# Altium project HORNET_MOTOR_CONTROLLER.PrjPcb (part 1 of 2)
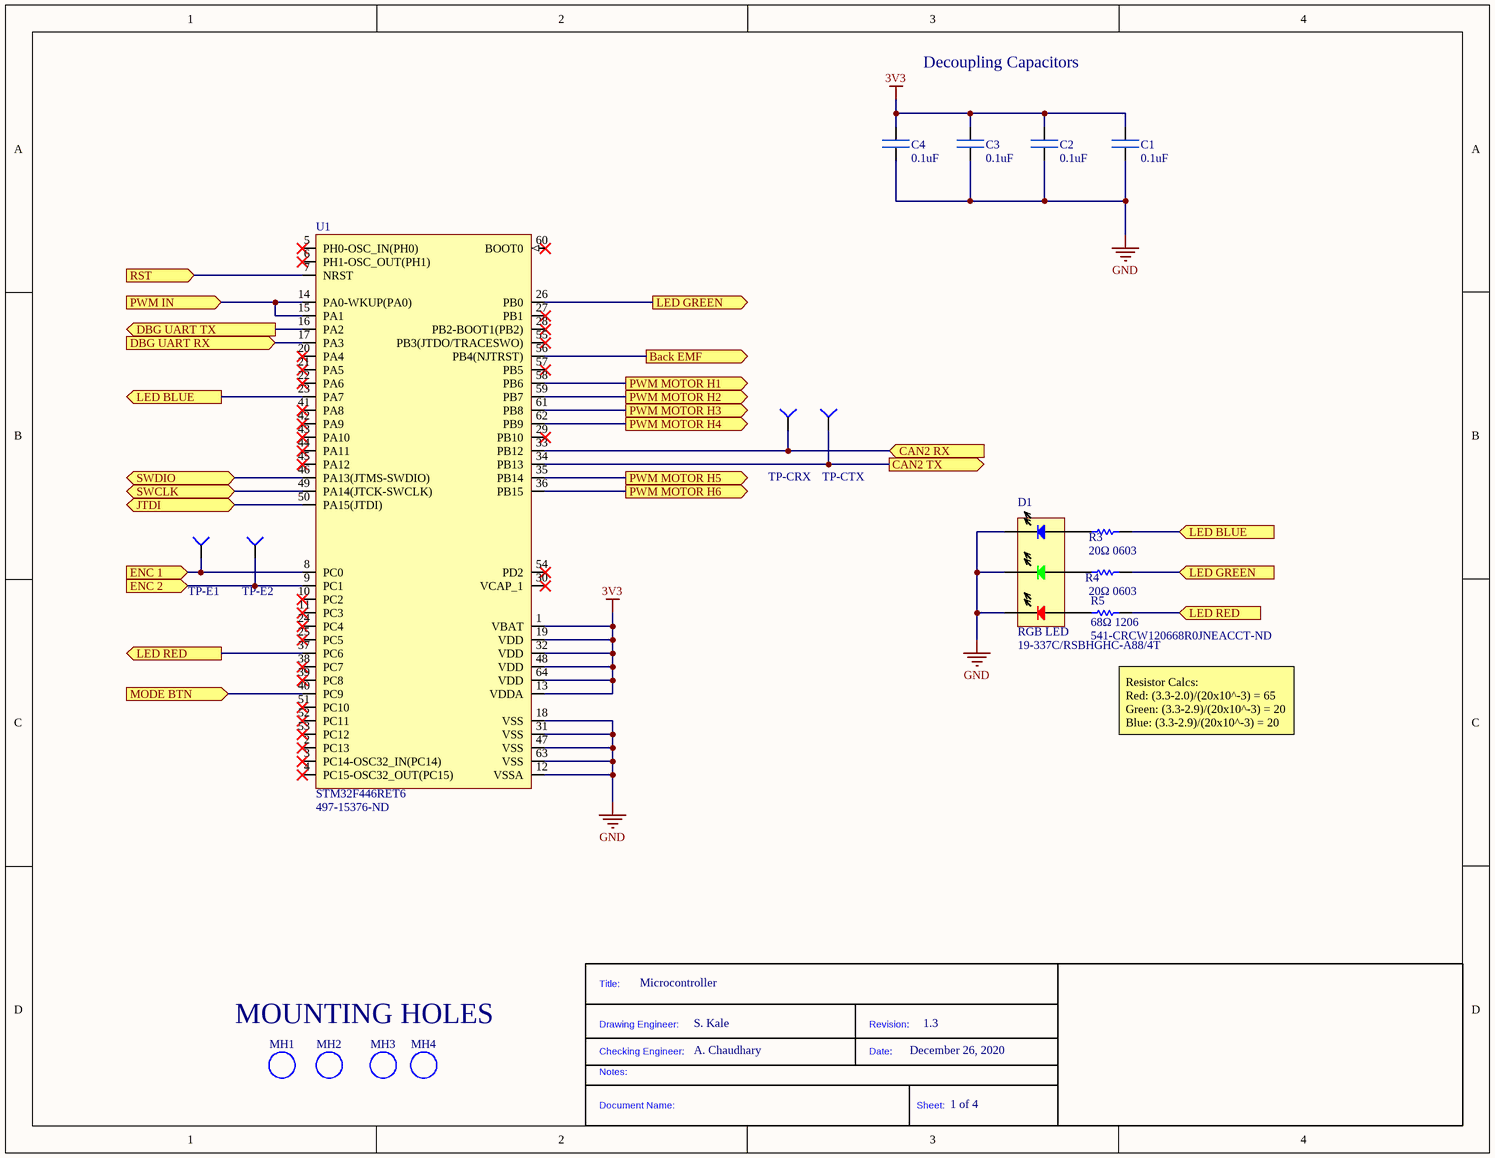
[diagram p0: SH1 - STM32.SchDoc]
4 sheets, 88 parts. Net scope: flat (ports and power ports of the same name join across sheets).
Board file: HornetPCB.PcbDoc
Sheets:
  SH1 - STM32.SchDoc
  SH2 - HBridge.SchDoc
  SH3 - Debug Communication.SchDoc
  SH4 - PWM + CAN.SchDoc

## Sheet SH1 - STM32.SchDoc
size Letter

### Parts
(Parts that share a designator on the sheet are numbered #1, #2 ... from top to bottom, then left to right.)
*  HORNET LOGO  (value not drawn)  (graphical)
?#1  TitleBlock  (value not drawn)  (graphical)
C1  0.1uF  [CAP0.1uF]
C2  0.1uF  [CAP0.1uF]
C3  0.1uF  [CAP0.1uF]
C4  0.1uF  [CAP0.1uF]
D1  RGB LED  [19-337C/RSBHGHC-A88/4T]
MH1  MOUNTING HOLE  [MOUNTING HOLE]  (value not drawn)
MH2  MOUNTING HOLE  [MOUNTING HOLE]  (value not drawn)
MH3  MOUNTING HOLE  [MOUNTING HOLE]  (value not drawn)
MH4  MOUNTING HOLE  [MOUNTING HOLE]  (value not drawn)
R3  20Ω 0603  [SDR03EZPJ200]
R4  20Ω 0603  [SDR03EZPJ200]
R5  68Ω 1206  Supplier Part Number 1: 541-CRCW120668R0JNEACCT-ND  [CRCW120668R0JNEAC]
TP-CRX  TESTPT  [TESTPT SQUARE]  (value not drawn)
TP-CTX  TESTPT  [TESTPT SQUARE]  (value not drawn)
TP-E1  TESTPT  [TESTPT SQUARE]  (value not drawn)
TP-E2  TESTPT  [TESTPT SQUARE]  (value not drawn)
U1  STM32F446RET6  Supplier Part Number 1: 497-15376-ND  [STM_LQFP64_N]

### Ports
Back EMF (out), CAN2 RX (in), CAN2 TX (out), DBG UART RX (in), DBG UART TX (out), ENC 1 (in), ENC 2 (in), JTDI (bidir), LED BLUE (in), LED BLUE (out), LED GREEN (in), LED GREEN (out), LED RED (in), LED RED (out), MODE BTN (in), PWM IN (in), PWM MOTOR H1 (out), PWM MOTOR H2 (out), PWM MOTOR H3 (out), PWM MOTOR H4 (out), PWM MOTOR H5 (out), PWM MOTOR H6 (out), RST (in), SWCLK (bidir), SWDIO (bidir)

### Nets
3V3: C1.2 C2.2 C3.2 C4.2 U1.1(VBAT) U1.13(VDDA) U1.19(VDD) U1.32(VDD) U1.48(VDD) U1.64(VDD)
GND: C1.1 C2.1 C3.1 C4.1 D1.1(GREEN_-) D1.3(RED_-) D1.5(BLUE_-) U1.12(VSSA) U1.18(VSS) U1.31(VSS) U1.47(VSS) U1.63(VSS)
NetD1_2: D1.2(Green_+) R4.1
NetD1_4: D1.4(Red_+) R5.1
NetD1_6: D1.6(Blue_+) R3.1
NetJ0_1: TP-E1.1(=value) U1.8(PC0) ; port ENC 1
NetJ1_1: TP-E2.1(=value) U1.9(PC1) ; port ENC 2
NetJ8_1: U1.7(NRST) ; port RST
NetJ8_2: U1.46(PA13(JTMS-SWDIO)) ; port SWDIO
NetJ8_5: U1.50(PA15(JTDI)) ; port JTDI
NetJ8_6: U1.49(PA14(JTCK-SWCLK)) ; port SWCLK
NetMODE_2: U1.40(PC9) ; port MODE BTN
NetQ1_1: U1.58(PB6) ; port PWM MOTOR H1
NetQ2_1: U1.59(PB7) ; port PWM MOTOR H2
NetQ3_1: U1.61(PB8) ; port PWM MOTOR H3
NetQ4_1: U1.62(PB9) ; port PWM MOTOR H4
NetQ5_1: U1.35(PB14) ; port PWM MOTOR H5
NetQ6_1: U1.36(PB15) ; port PWM MOTOR H6
NetQ7_1: U1.56(PB4(NJTRST)) ; port Back EMF
NetR3_2: R3.2 U1.23(PA7) ; port LED BLUE
NetR4_2: R4.2 U1.26(PB0) ; port LED GREEN
NetR5_2: R5.2 U1.37(PC6) ; port LED RED
NetR10_2: U1.17(PA3) ; port DBG UART RX
NetR11_2: U1.16(PA2) ; port DBG UART TX
NetR21_2: U1.14(PA0-WKUP(PA0)) U1.15(PA1) ; port PWM IN
NetTP-CRX_1: TP-CRX.1(=value) U1.33(PB12) ; port CAN2 RX
NetTP-CTX_1: TP-CTX.1(=value) U1.34(PB13) ; port CAN2 TX

Not connected (* = marked no-connect by the designer): U1 2(PC13)* 3(PC14-OSC32_IN(PC14))* 4(PC15-OSC32_OUT(PC15))* 5(PH0-OSC_IN(PH0))* 6(PH1-OSC_OUT(PH1))* 10(PC2)* 11(PC3)* 20(PA4)* 21(PA5)* 22(PA6)* 24(PC4)* 25(PC5)* 27(PB1)* 28(PB2-BOOT1(PB2))* 29(PB10)* 30(VCAP_1)* 38(PC7)* 39(PC8)* 41(PA8)* 42(PA9)* 43(PA10)* 44(PA11)* 45(PA12)* 51(PC10)* 52(PC11)* 53(PC12)* 54(PD2)* 55(PB3(JTDO/TRACESWO))* 57(PB5)* 60(BOOT0)*

### Notes on the sheet
- Decoupling Capacitors
- Resistor Calcs:
  Red: (3.3-2.0)/(20x10^-3) = 65
  Green: (3.3-2.9)/(20x10^-3) = 20
  Blue: (3.3-2.9)/(20x10^-3) = 20
- MOUNTING HOLES
- Microcontroller
- S. Kale
- 1.3
- A. Chaudhary
- December 26, 2020
- 1 of 4
- (in symbol TitleBlock) Title:; Drawing Engineer:; Revision:; Checking Engineer:; Date:; Notes:; Document Name:; Sheet:

### Library data of the parts
?#1 = TitleBlock: Standard Title Block
C1-C4 = CAP 0.1uF: Ceramic Capacitor, Multilayer, Ceramic, 16V, 10% +Tol, 10% -Tol, X7R, 15% TC, 0.1uF, Surface Mount, 0402; Manufacturer: Murata; Manufacturer Part Number: GRM155R71C104KA88D; Capacitance: 100nF; Multilayer: Yes; Supplier 1: Digi-Key; RoHS: Yes; Category: Ceramic Capacitors; Stock 1: 19996896; Pricing 1: 1=0.10000, 10=0.02100, 50=0.01140, 100=0.00930, 500=0.00666, 1000=0.00523, 2500=0.00476, 5000=0.00438 (USD); Mount: Surface Mount; Number of Pins: 2; Dielectric Material: Ceramic; Size Code: 0402; Terminal Finish: Nickel; Package Shape: Rectangular; Min Operating Temperature: -55°C; Max Operating Temperature: 125°C; JESD-609 Code: e3; Capacitor Type: Ceramic; Negative Tolerance: 10%; Packaging: Tape and Reel; Positive Tolerance: 10%; Rated DC Voltage (URdc): 16V; Temperature Characteristics Code: X7R; Termination: Wraparound; Package Style: SMTMeter; Length: 1mm; Width: 0.5mm; ComponentLink1URL: https://psearch.en.murata.com:443/capacitor/product/GRM155R71C104KA88%23.pdf?src-supplier=IHS+Markit; ComponentLink1Description: https://psearch.en.murata.com:443/capacitor/product/GRM155R71C104KA88%23.pdf?src-supplier=IHS+Markit; ComponentLink2URL: https://datasheet.ciiva.com/129/grm155r71c104ka88-01-129740.pdf?src-supplier=Digi-Key; ComponentLink2Description: https://datasheet.ciiva.com/129/grm155r71c104ka88-01-129740.pdf?src-supplier=Digi-Key; ComponentLink3URL: https://datasheet.ciiva.com/18102/getdatasheetpartid-85307-18102905.pdf?src-supplier=Verical; ComponentLink3Description: https://datasheet.ciiva.com/18102/getdatasheetpartid-85307-18102905.pdf?src-supplier=Verical; ComponentLink4URL: https://datasheet.ciiva.com/129/grm155r71c104ka88-01-129739.pdf?src-supplier=Digi-Key; ComponentLink4Description: https://datasheet.ciiva.com/129/grm155r71c104ka88-01-129739.pdf?src-supplier=Digi-Key; ComponentLink5URL: https://datasheet.ciiva.com/29199/454098-da-01-en-vs-kondensator-0402-29199799.pdf?src-supplier=Conrad; ComponentLink5Description: https://datasheet.ciiva.com/29199/454098-da-01-en-vs-kondensator-0402-29199799.pdf?src-supplier=Conrad; ComponentLink6URL: https://datasheet.ciiva.com/28534/4360-28534133.pdf?src-supplier=Element14; ComponentLink6Description: https://datasheet.ciiva.com/28534/4360-28534133.pdf?src-supplier=Element14; ComponentLink7URL: https://datasheet.ciiva.com/14103/grmseries-highdielectrictype-eng-14103750.pdf?src-supplier=Distrelec; ComponentLink7Description: https://datasheet.ciiva.com/14103/grmseries-highdielectrictype-eng-14103750.pdf?src-supplier=Distrelec; ComponentLink8URL: https://datasheet.ciiva.com/16199/product-16199000.pdf?src-supplier=Future+Electronics; ComponentLink8Description: https://datasheet.ciiva.com/16199/product-16199000.pdf?src-supplier=Future+Electronics; ComponentLink9URL: https://datasheet.ciiva.com/14116/grmseries-highdielectrictype-eng-14116878.pdf?src-supplier=Distrelec; ComponentLink9Description: https://datasheet.ciiva.com/14116/grmseries-highdielectrictype-eng-14116878.pdf?src-supplier=Distrelec; ComponentLink10URL: https://datasheet.ciiva.com/7937/4360-7937615.pdf?src-supplier=Element14; ComponentLink10Description: https://datasheet.ciiva.com/7937/4360-7937615.pdf?src-supplier=Element14; ComponentLink11URL: https://datasheet.ciiva.com/28534/4360-28534127.pdf?src-supplier=Element14; ComponentLink11Description: https://datasheet.ciiva.com/28534/4360-28534127.pdf?src-supplier=Element14; Height: 0.5mm; Supplier Part Number 1: 490-3261-1-ND
D1 = LED_RGB: Tri Color Pcb Top View SMD Led R; Manufacturer: Everlight; Supplier 1: Digi-Key; Manufacturer Part Number: 19-337C/RSBHGHC-A88/4T; RoHS: No; Category: LEDs; Stock 1: 109225; Pricing 1: 1=0.40000, 10=0.24400, 100=0.14030, 1000=0.10980, 2000=0.10065 (USD); Supplier Part Number 1: 1080-1631-1-ND
R3 R4 = RES 20Ω: Fixed Resistor, 0.1W, 20ohm, 50V, 5% +/-Tol, 200ppm/Cel, Surface Mount, 0603; Manufacturer: Rohm; Additional Feature: ANTI-SULFUR; Rated Power Dissipation (P): 100mW; Rated Temperature: 70°C; Resistance: 20R; Temperature Coefficient: 200ppm/°C; Reference Standard: TS 16949; Supplier 1: Digi-Key; Manufacturer Part Number: SDR03EZPJ200; RoHS: No; Category: Chip SMD Resistors; Stock 1: 3900; Pricing 1: 1=0.10000, 10=0.07300, 100=0.02800, 1000=0.01232, 2500=0.01064 (USD); Mount: Surface Mount; Number of Pins: 2; Package Shape: Rectangular; Size Code: 0603; Min Operating Temperature: -55°C; Max Operating Temperature: 155°C; Tolerance: 5%; Resistor Type: FIXED RESISTOR; Packaging: Tape and Reel; Termination: Wraparound; Working Voltage: 50V; ComponentLink1URL: https://datasheet.ciiva.com:443/pdfs/VipMasterIC/IC/ROHM/ROHM-S-A0002832543/ROHM-S-A0002832543-1.pdf?src-supplier=IHS+Markit; ComponentLink1Description: https://datasheet.ciiva.com:443/pdfs/VipMasterIC/IC/ROHM/ROHM-S-A0002832543/ROHM-S-A0002832543-1.pdf?src-supplier=IHS+Markit; ComponentLink2URL: https://www.rohm.com/datasheet/SDR03EZPJ/sdr-e?src-supplier=Digi-Key; ComponentLink2Description: https://www.rohm.com/datasheet/SDR03EZPJ/sdr-e?src-supplier=Digi-Key; Supplier Part Number 1: 511-1747-1-ND
R5 = RES 68Ω: VISCRCW120668R0JNEAC Res Thick Film 1206; Manufacturer: Vishay; Tolerance: 5%; Rated Power Dissipation (P): 250mW; Resistance: 68R; Temperature Coefficient: -200200ppm/°C; Working Voltage: 200V; Package Height: 0.55mm; Package Length: 3.05mm; Package Width: 1.55mm; Supplier 1: Digi-Key; Manufacturer Part Number: CRCW120668R0JNEAC; Stock 1: 24990; Pricing 1: 1=0.10000, 10=0.06300, 100=0.02570, 1000=0.01153, 2500=0.01000 (USD); Number of Pins: 2; Size Code: 1206; Terminal Finish: Nickel; Min Operating Temperature: -55°C; Max Operating Temperature: 155°C; JESD-609 Code: e3; Resistor Type: FIXED RESISTOR; Construction: Chip; Package Style: SMTMeter; Packaging: Tape and Reel; Technology: METAL GLAZE/THICK FILM; ComponentLink1URL: https://datasheet.ciiva.com:443/pdfs/VipMasterIC/IC/VISH/VISH-S-A0003599164/VISH-S-A0003599164-1.pdf?src-supplier=IHS+Markit; ComponentLink1Description: https://datasheet.ciiva.com:443/pdfs/VipMasterIC/IC/VISH/VISH-S-A0003599164/VISH-S-A0003599164-1.pdf?src-supplier=IHS+Markit
TP-CRX TP-CTX TP-E1 TP-E2 = TESTPT SQUARE
U1 = STM32F446RET6: RISC Microcontroller, 32-Bit, FLASH, CORTEX-M4F CPU, 180MHz, CMOS, PQFP64; Manufacturer: STMicroelectronics; Package Body Material: Plastic; Package Equivalence Code: QFP64,.47SQ,20; Power Supplies: 1.8/3.3V; Speed: 180RPM; Max Supply Current: 115mA; Qualification Status: Not Qualified; Parameter 1: *; Supplier 1: Digi-Key; Manufacturer Part Number: STM32F446RET6; RoHS: Yes; Category: Microcontrollers; Pricing 1: 1=9.05000, 10=8.17300, 25=7.79320, 160=6.76675, 320=6.46266, 480=5.89242, 960=5.13210, 2400=4.94202, 4960=4.75194 (USD); Package Code: QFP; Number of Pins: 64; Package Shape: Square; Min Operating Temperature: -40°C; Max Operating Temperature: 85°C; JESD-30 Code: S-PQFP-G64; Package Style: FLATPACKMeter; Surface Mount: Yes; Technology: CMOS; Terminal Form: Gull Wing; Terminal Position: QUAD; Terminal Pitch: 0.5mm; Temperature Grade: INDUSTRIAL; ComponentLink1URL: https://datasheet.ciiva.com:443/pdfs/VipMasterIC/IC/SGST/SGST-S-A0000954157/SGST-S-A0000954273-1.pdf?src-supplier=IHS+Markit; ComponentLink1Description: https://datasheet.ciiva.com:443/pdfs/VipMasterIC/IC/SGST/SGST-S-A0000954157/SGST-S-A0000954273-1.pdf?src-supplier=IHS+Markit; ComponentLink2URL: http://www.farnell.com/datasheets/2309063.pdf?src-supplier=Farnell; ComponentLink2Description: http://www.farnell.com/datasheets/2309063.pdf?src-supplier=Farnell; ComponentLink3URL: http://www.mouser.com/ds/2/389/stm32f446mc-956216.pdf?src-supplier=Mouser; ComponentLink3Description: http://www.mouser.com/ds/2/389/stm32f446mc-956216.pdf?src-supplier=Mouser; ComponentLink4URL: http://www.farnell.com/datasheets/2309063.pdf?src-supplier=Newark; ComponentLink4Description: http://www.farnell.com/datasheets/2309063.pdf?src-supplier=Newark; ComponentLink5URL: http://www.st.com/content/ccc/resource/technical/document/datasheet/65/cb/75/50/53/d6/48/24/DM00141306.pdf/files/DM00141306.pdf/jcr:content/translations/en.DM00141306.pdf?src-supplier=Digi-Key; ComponentLink5Description: http://www.st.com/content/ccc/resource/technical/document/datasheet/65/cb/75/50/53/d6/48/24/DM00141306.pdf/files/DM00141306.pdf/jcr:content/translations/en.DM00141306.pdf?src-supplier=Digi-Key; ComponentLink6URL: http://www.farnell.com/datasheets/2309063.pdf?src-supplier=Element14; ComponentLink6Description: http://www.farnell.com/datasheets/2309063.pdf?src-supplier=Element14

## Sheet SH2 - HBridge.SchDoc
size Letter
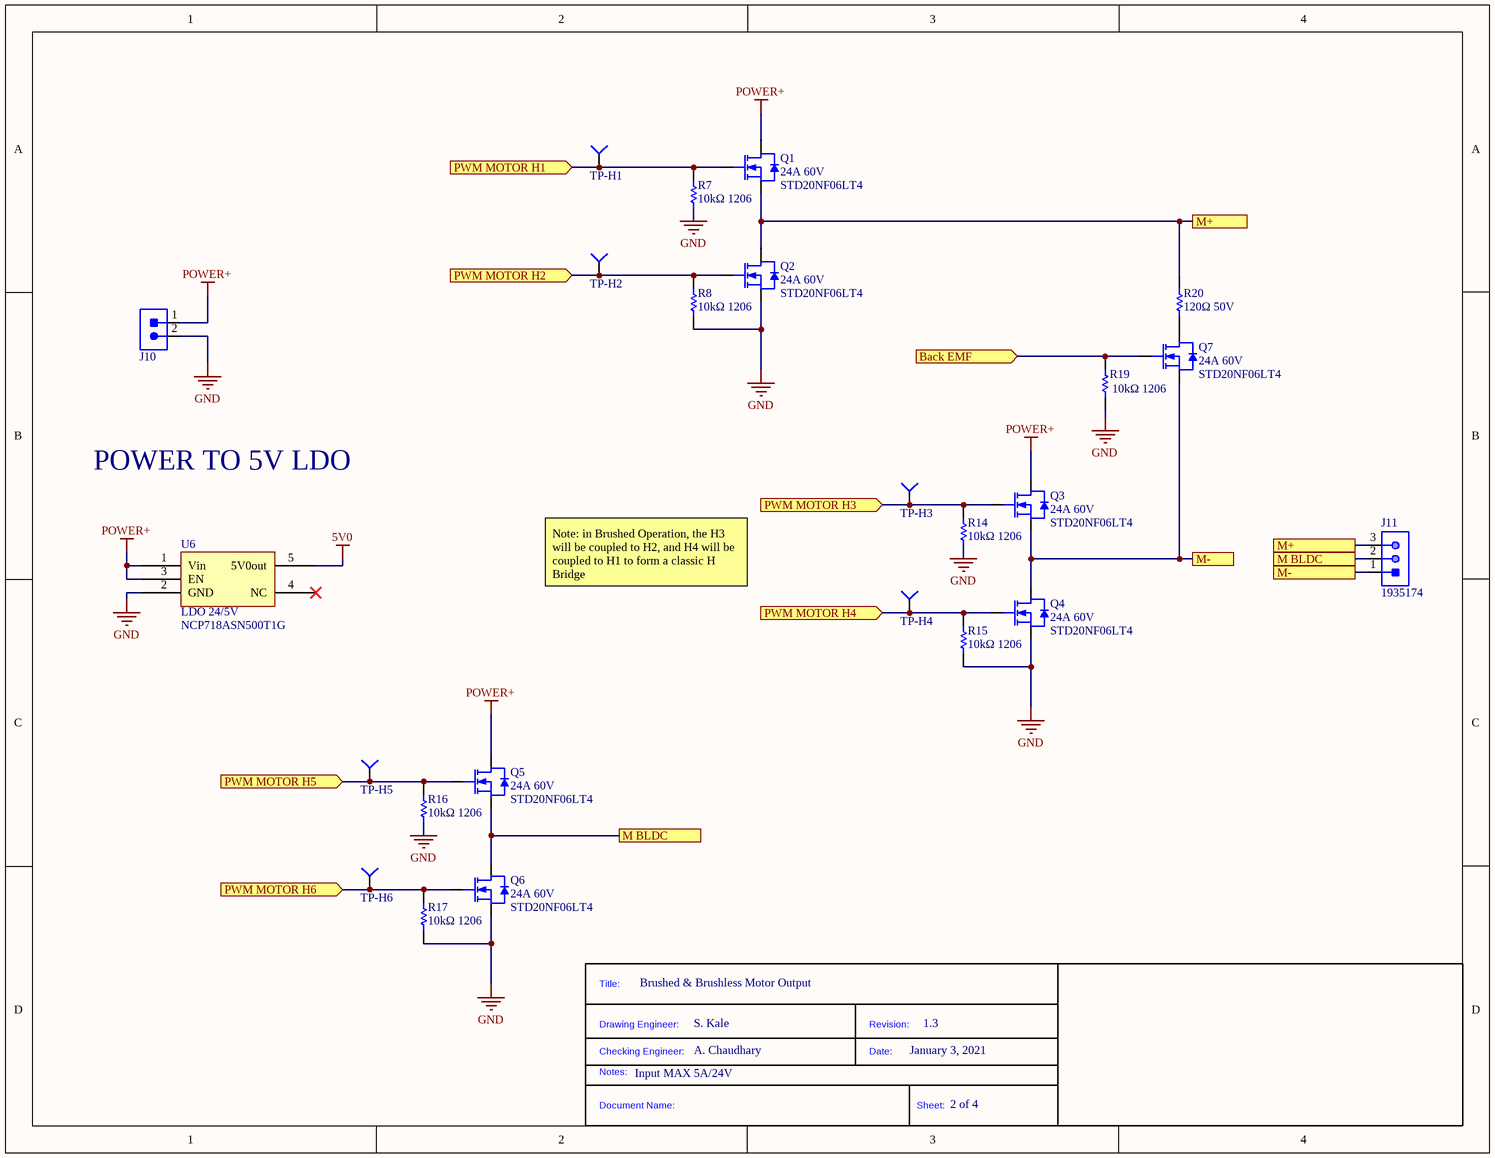
[diagram p1: SH2 - HBridge.SchDoc]

### Parts
(Parts that share a designator on the sheet are numbered #1, #2 ... from top to bottom, then left to right.)
*?#1  HORNET LOGO  (value not drawn)  (graphical)
?#2  TitleBlock  (value not drawn)  (graphical)
J10  CON 2-SCREW  [1935161]  (value not drawn)
J11  CON 3-SCREW  [1935174]  (value not drawn)
Q1  24A 60V  [STD20NF06LT4]
Q2  24A 60V  [STD20NF06LT4]
Q3  24A 60V  [STD20NF06LT4]
Q4  24A 60V  [STD20NF06LT4]
Q5  24A 60V  [STD20NF06LT4]
Q6  24A 60V  [STD20NF06LT4]
Q7  24A 60V  [STD20NF06LT4]
R7  10kΩ 1206  [13-RE1206FRE0710KLCT-ND]
R8  10kΩ 1206  [13-RE1206FRE0710KLCT-ND]
R14  10kΩ 1206  [13-RE1206FRE0710KLCT-ND]
R15  10kΩ 1206  [13-RE1206FRE0710KLCT-ND]
R16  10kΩ 1206  [13-RE1206FRE0710KLCT-ND]
R17  10kΩ 1206  [13-RE1206FRE0710KLCT-ND]
R19  10kΩ 1206  [13-RE1206FRE0710KLCT-ND]
R20  120Ω 50V  [SDR03EZPJ200]
TP-H1  TESTPT  [TESTPT SQUARE]  (value not drawn)
TP-H2  TESTPT  [TESTPT SQUARE]  (value not drawn)
TP-H3  TESTPT  [TESTPT SQUARE]  (value not drawn)
TP-H4  TESTPT  [TESTPT SQUARE]  (value not drawn)
TP-H5  TESTPT  [TESTPT SQUARE]  (value not drawn)
TP-H6  TESTPT  [TESTPT SQUARE]  (value not drawn)
U6  LDO 24/5V  [NCP718ASN500T1G]

### Ports
Back EMF (in), M BLDC, M+, M-, PWM MOTOR H1 (in), PWM MOTOR H2 (in), PWM MOTOR H3 (in), PWM MOTOR H4 (in), PWM MOTOR H5 (in), PWM MOTOR H6 (in)

### Nets
5V0: U6.5(5V0out)
GND: J10.2 Q2.3(Source) Q4.3(Source) Q6.3(Source) R7.1 R8.1 R14.1 R15.1 R16.1 R17.1 R19.1 U6.2(GND)
POWER+: J10.1 Q1.2(Drain) Q3.2(Drain) Q5.2(Drain) U6.1(Vin) U6.3(EN)
NetJ11_1: J11.1 Q3.3(Source) Q4.2(Drain) Q7.3(Source) ; port M-
NetJ11_2: J11.2 Q5.3(Source) Q6.2(Drain) ; port M BLDC
NetJ11_3: J11.3 Q1.3(Source) Q2.2(Drain) R20.2 ; port M+
NetQ1_1: Q1.1(Gate) R7.2 TP-H1.1(=value) ; port PWM MOTOR H1
NetQ2_1: Q2.1(Gate) R8.2 TP-H2.1(=value) ; port PWM MOTOR H2
NetQ3_1: Q3.1(Gate) R14.2 TP-H3.1(=value) ; port PWM MOTOR H3
NetQ4_1: Q4.1(Gate) R15.2 TP-H4.1(=value) ; port PWM MOTOR H4
NetQ5_1: Q5.1(Gate) R16.2 TP-H5.1(=value) ; port PWM MOTOR H5
NetQ6_1: Q6.1(Gate) R17.2 TP-H6.1(=value) ; port PWM MOTOR H6
NetQ7_1: Q7.1(Gate) R19.2 ; port Back EMF
NetQ7_2: Q7.2(Drain) R20.1

Not connected (* = marked no-connect by the designer): U6 4(NC)*

### Notes on the sheet
- POWER TO 5V LDO
- Note: in Brushed Operation, the H3 will be coupled to H2, and H4 will be coupled to H1 to form a classic H Bridge
- Brushed & Brushless Motor Output
- S. Kale
- 1.3
- Input MAX 5A/24V
- A. Chaudhary
- January 3, 2021
- 2 of 4
- (in symbol TitleBlock) Title:; Drawing Engineer:; Revision:; Checking Engineer:; Date:; Notes:; Document Name:; Sheet:

### Library data of the parts
?#2 = TitleBlock: Standard Title Block
J10 = CON 2-SCREW: TERM BLK 2POS SIDE ENTRY 5MM; Manufacturer 1: Phoenix Contact; Package/Footprint: SMD; Supplier 1: Digi-Key; Mounting Type: TH; Supplier Part Number 1: 277-1667-ND; Manufacturer Part Number 1: 1935161
J11 = CON 3-SCREW: TERM BLK 3POS SIDE ENTRY 5MM; Manufacturer 1: Phoenix Contact; Package/Footprint: TH; Voltage Rating: 250V; Current Rating: 17.5A; Supplier 1: Digi-Key; Mounting Type: TH; Orientation: Straight; Pitch: 5mm; Supplier Part Number 1: 277-1578-ND; Manufacturer Part Number 1: 1935174
Q1-Q7 = MOSFET: Power Field-Effect Transistor, 24A I(D), 60V, 0.05ohm, 1-Element, N-Channel, Silicon, Metal-oxide Semiconductor FET, TO-252AA; Manufacturer: STMicroelectronics; Package Body Material: Plastic; Avalanche Energy Rating (Eas): 225mJ; Drain-source On Resistance-Max: 50mR; Number of Elements: 1; Operating Mode: ENHANCEMENT MODE; Power Dissipation-Max (Abs): 60W; Pulsed Drain Current-Max (IDM): 96A; Time @ Peak Reflow Temperature-Max (s): 30s; Transistor Application: SWITCHING; Qualification Status: Not Qualified; Supplier 1: Digi-Key; Manufacturer Part Number: STD20NF06LT4; RoHS: Yes; Category: MOSFETs; Stock 1: 17979; Pricing 1: 1=0.99000, 10=0.81000, 25=0.79520, 100=0.63000, 500=0.53400, 1000=0.43500 (USD); Number of Pins: 2; Package Shape: Rectangular; Terminal Finish: Tin; Transistor Element Material: SILICON; Max Operating Temperature: 175°C; JESD-609 Code: e3; Polarity/Channel Type: N-CHANNEL; Drain Current-Max (Abs) (ID): 24A; Drain Current-Max (ID): 24A; DS Breakdown Voltage-Min: 60V; FET Technology: METAL-OXIDE SEMICONDUCTOR; JESD-30 Code: R-PSSO-G2; Moisture Sensitivity Level: 1; Package Style: SMALL OUTLINEMeter; Peak Reflow Temperature (Cel): 260°C; Surface Mount: Yes; Terminal Form: Gull Wing; Terminal Position: SINGLE; JEDEC-95 Code: TO-252AA; ComponentLink1URL: https://datasheet.ciiva.com:443/pdfs/VipMasterIC/IC/SGST/SGSTS16849/SGSTS16849-1.pdf?src-supplier=IHS+Markit; ComponentLink1Description: https://datasheet.ciiva.com:443/pdfs/VipMasterIC/IC/SGST/SGSTS16849/SGSTS16849-1.pdf?src-supplier=IHS+Markit; ComponentLink2URL: https://datasheet.ciiva.com/5774/129580-5774199.pdf?src-supplier=Farnell; ComponentLink2Description: https://datasheet.ciiva.com/5774/129580-5774199.pdf?src-supplier=Farnell; ComponentLink3URL: https://datasheet.ciiva.com/4442/cd00003407-43085-4442056.pdf?src-supplier=Mouser; ComponentLink3Description: https://datasheet.ciiva.com/4442/cd00003407-43085-4442056.pdf?src-supplier=Mouser; ComponentLink4URL: https://datasheet.ciiva.com/25625/0900766b810e88d3-25625611.pdf?src-supplier=RSComponents; ComponentLink4Description: https://datasheet.ciiva.com/25625/0900766b810e88d3-25625611.pdf?src-supplier=RSComponents; ComponentLink5URL: https://datasheet.ciiva.com/46451/1398479-46451621.pdf?src-supplier=Jameco; ComponentLink5Description: https://datasheet.ciiva.com/46451/1398479-46451621.pdf?src-supplier=Jameco; ComponentLink6URL: https://datasheet.ciiva.com/16220/cd00003407-16220218.pdf?src-supplier=Future+Electronics; ComponentLink6Description: https://datasheet.ciiva.com/16220/cd00003407-16220218.pdf?src-supplier=Future+Electronics; ComponentLink7URL: https://datasheet.ciiva.com/17320/cd00003407-17320843.pdf?src-supplier=Avnet+Europe; ComponentLink7Description: https://datasheet.ciiva.com/17320/cd00003407-17320843.pdf?src-supplier=Avnet+Europe; ComponentLink8URL: https://datasheet.ciiva.com/937/cd00003407-937437.pdf?src-supplier=Digi-Key; ComponentLink8Description: https://datasheet.ciiva.com/937/cd00003407-937437.pdf?src-supplier=Digi-Key; ComponentLink9URL: https://datasheet.ciiva.com/937/cd00003407-937438.pdf?src-supplier=Digi-Key; ComponentLink9Description: https://datasheet.ciiva.com/937/cd00003407-937438.pdf?src-supplier=Digi-Key; ComponentLink10URL: https://datasheet.ciiva.com/937/cd00003407-937439.pdf?src-supplier=Digi-Key; ComponentLink10Description: https://datasheet.ciiva.com/937/cd00003407-937439.pdf?src-supplier=Digi-Key; Supplier Part Number 1: 497-5888-1-ND
R7 R8 R14-R17 R19 = RES 10k Ω: Fixed Resistor, Metal Glaze/thick Film, 0.25W, 10000ohm, 200V, 1% +/-Tol, 50ppm/Cel, Surface Mount, 1206; Manufacturer: Yageo; Manufacturer Part Number: RE1206FRE0710KL; Supplier 1: Digi-Key; RoHS: Yes; Category: Chip SMD Resistors; Stock 1: 6708; Pricing 1: 1=0.10000, 10=0.05900, 100=0.02390, 1000=0.01073, 2500=0.00932 (USD); ComponentLink1URL: https://datasheet.ciiva.com:443/pdfs/VipMasterIC/IC/YAGO/YAGO-S-A0003975721/YAGO-S-A0003975721-1.pdf?src-supplier=IHS+Markit; ComponentLink1Description: https://datasheet.ciiva.com:443/pdfs/VipMasterIC/IC/YAGO/YAGO-S-A0003975721/YAGO-S-A0003975721-1.pdf?src-supplier=IHS+Markit; ComponentLink2URL: http://www.yageo.com/NewPortal/yageodocoutput?fileName=/pdf/R-Chip/PYu-RE_105_RoHS_L_4.pdf&src-supplier=Digi-Key; ComponentLink2Description: http://www.yageo.com/NewPortal/yageodocoutput?fileName=/pdf/R-Chip/PYu-RE_105_RoHS_L_4.pdf&src-supplier=Digi-Key; Supplier Part Number 1: 13-RE1206FRE0710KLCT-ND
R20 = RES 120: Fixed Resistor, 0.1W, 120ohm, 50V, 5% +/-Tol, 200ppm/Cel, Surface Mount, 0603; Manufacturer: Rohm; Manufacturer Part Number: SDR03EZPJ121; Supplier 1: Digi-Key; RoHS: No; Category: Chip SMD Resistors; Stock 1: 4798; Pricing 1: 1=0.10000, 10=0.07300, 100=0.02800, 1000=0.01232, 2500=0.01064 (USD); ComponentLink1URL: https://datasheet.ciiva.com:443/pdfs/VipMasterIC/IC/ROHM/ROHM-S-A0002832543/ROHM-S-A0002832543-1.pdf?src-supplier=IHS+Markit; ComponentLink1Description: https://datasheet.ciiva.com:443/pdfs/VipMasterIC/IC/ROHM/ROHM-S-A0002832543/ROHM-S-A0002832543-1.pdf?src-supplier=IHS+Markit; ComponentLink2URL: https://www.rohm.com/datasheet/SDR03EZPJ/sdr-e?src-supplier=Digi-Key; ComponentLink2Description: https://www.rohm.com/datasheet/SDR03EZPJ/sdr-e?src-supplier=Digi-Key; Supplier Part Number 1: 511-1735-1-ND
TP-H1-TP-H6 = TESTPT SQUARE
U6 = LDO 24/5V: Fixed Positive LDO Regulator, 5V, 0.38V Dropout, PDSO5; Manufacturer: ON Semiconductor; Regulator Type: FIXED POSITIVE SINGLE OUTPUT LDO REGULATOR; Supplier 1: Digi-Key; RoHS: No; Category: Voltage Regulators - Linear; Stock 1: 3776; Pricing 1: 1=0.39000, 10=0.33800, 25=0.31520, 100=0.23400, 250=0.19800, 500=0.18900, 1000=0.13950 (USD); ComponentLink1URL: https://datasheet.ciiva.com:443/pdfs/VipMasterIC/IC/ONSM/ONSM-S-A0008936508/ONSM-S-A0008936508-1.pdf?src-supplier=IHS+Markit; ComponentLink1Description: https://datasheet.ciiva.com:443/pdfs/VipMasterIC/IC/ONSM/ONSM-S-A0008936508/ONSM-S-A0008936508-1.pdf?src-supplier=IHS+Markit; ComponentLink2URL: http://www.farnell.com/datasheets/2711392.pdf?src-supplier=Farnell; ComponentLink2Description: http://www.farnell.com/datasheets/2711392.pdf?src-supplier=Farnell; ComponentLink3URL: https://www.onsemi.com/pub/Collateral/NCP718-D.PDF?src-supplier=Digi-Key; ComponentLink3Description: https://www.onsemi.com/pub/Collateral/NCP718-D.PDF?src-supplier=Digi-Key; ComponentLink4URL: http://www.farnell.com/datasheets/2711392.pdf?src-supplier=Newark; ComponentLink4Description: http://www.farnell.com/datasheets/2711392.pdf?src-supplier=Newark; Supplier Part Number 1: NCP718ASN500T1GOSCT-ND; Manufacturer Part Number: NCP718ASN500T1G

## Sheet SH3 - Debug Communication.SchDoc
size Letter
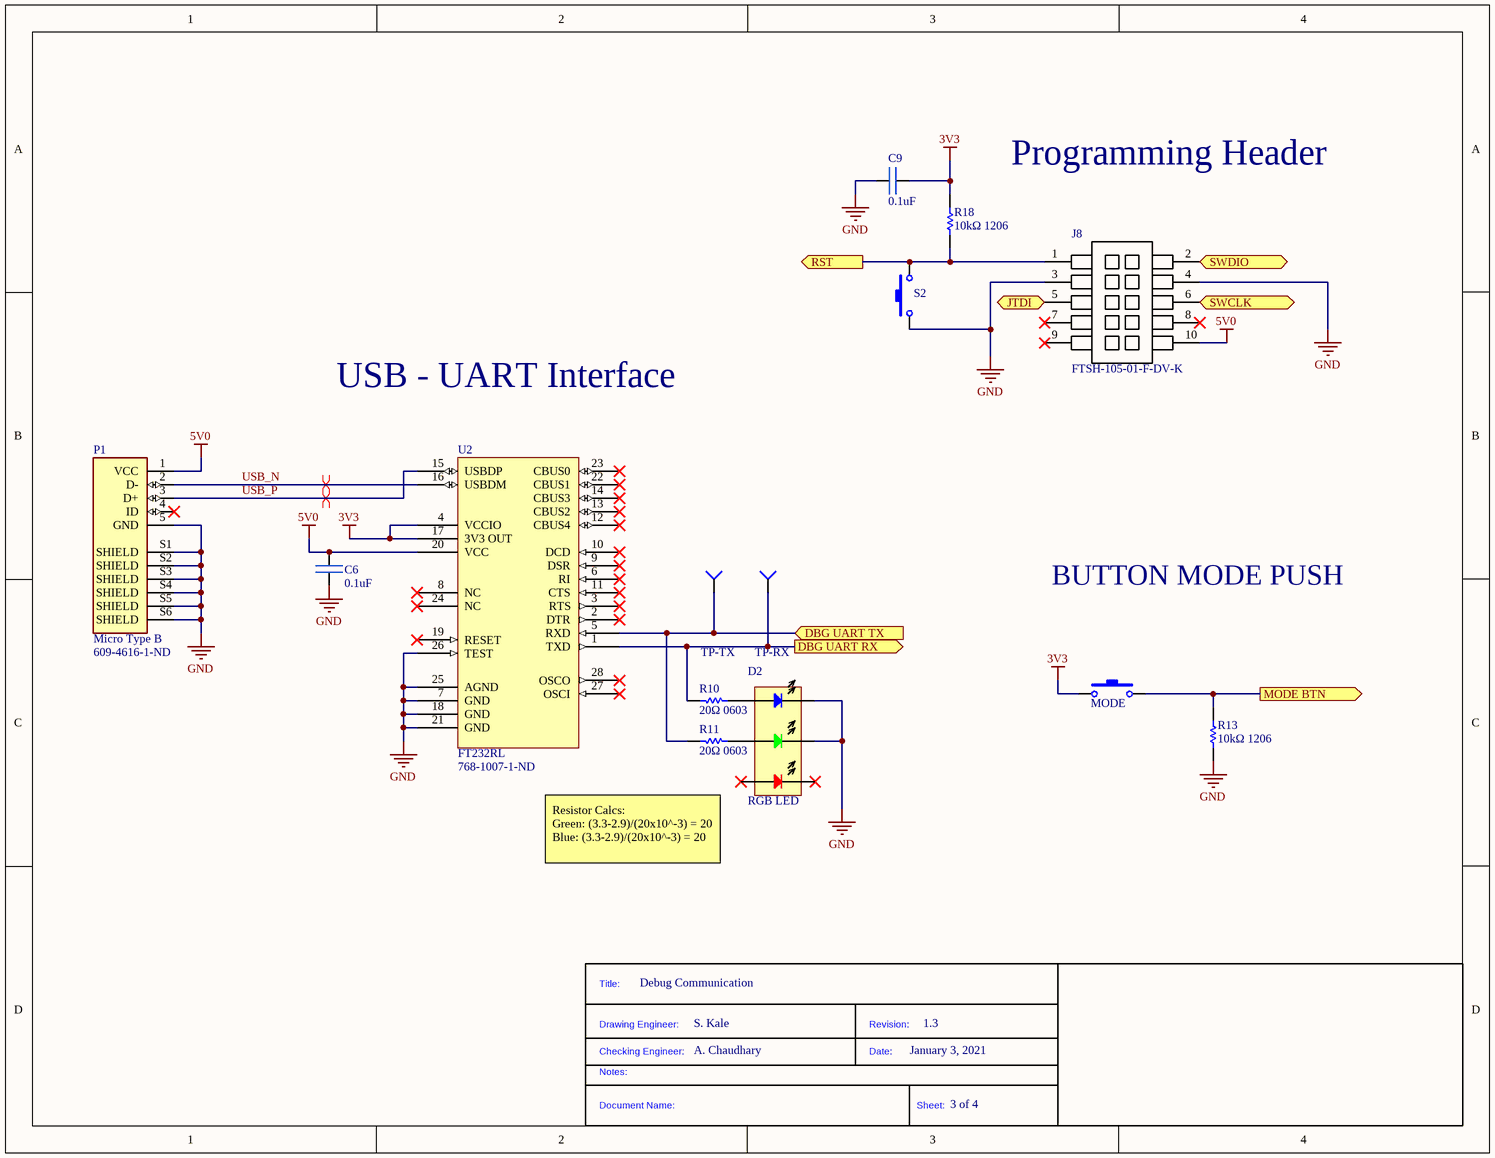
[diagram p2: SH3 - Debug Communication.SchDoc]

### Parts
(Parts that share a designator on the sheet are numbered #1, #2 ... from top to bottom, then left to right.)
*?#2  HORNET LOGO  (value not drawn)  (graphical)
?#3  TitleBlock  (value not drawn)  (graphical)
C6  0.1uF  [CAP0.1uF]
C9  0.1uF  [CAP0.1uF]
D2  RGB LED  [19-337C/RSBHGHC-A88/4T]
J8  Manufacturer Part Number 1: FTSH-105-01-F-DV-K  [FTSH-105-01-F-DV-K-P-TR]  (hidden comment: CON_STM32_PROGRAMMING)
MODE  SW_SPST_NO  [B3U-1000P]  (value not drawn)
P1  Micro Type B  Supplier Part Number 1: 609-4616-1-ND  [FCI_10118193-0001LF]
R10  20Ω 0603  [SDR03EZPJ200]
R11  20Ω 0603  [SDR03EZPJ200]
R13  10kΩ 1206  [13-RE1206FRE0710KLCT-ND]
R18  10kΩ 1206  [13-RE1206FRE0710KLCT-ND]
S2  SW_SPST_NO  [B3U-1000P]  (value not drawn)
TP-RX  TESTPT  [TESTPT SQUARE]  (value not drawn)
TP-TX  TESTPT  [TESTPT SQUARE]  (value not drawn)
U2  FT232RL  Supplier Part Number 1: 768-1007-1-ND  [FT232RL]

### Ports
DBG UART RX (out), DBG UART TX (in), JTDI (bidir), MODE BTN (out), RST (out), SWCLK (bidir), SWDIO (bidir)

### Nets
3V3: C9.1 MODE.1 R18.2 U2.4(VCCIO) U2.17(3V3_OUT)
5V0: C6.1 J8.10 P1.1(VCC) U2.20(VCC)
GND: C6.2 C9.2 D2.1(GREEN_-) D2.5(BLUE_-) J8.3 J8.4 P1.5(GND) P1.S1(SHIELD) P1.S2(SHIELD) P1.S3(SHIELD) P1.S4(SHIELD) P1.S5(SHIELD) P1.S6(SHIELD) R13.1 S2.1 U2.7(GND) U2.18(GND) U2.21(GND) U2.25(AGND) U2.26(TEST)
USB_N: P1.2(D-) U2.16(USBDM)
USB_P: P1.3(D+) U2.15(USBDP)
NetD2_2: D2.2(Green_+) R11.1
NetD2_6: D2.6(Blue_+) R10.1
NetJ8_1: J8.1 R18.1 S2.2 ; port RST
NetJ8_2: J8.2 ; port SWDIO
NetJ8_5: J8.5 ; port JTDI
NetJ8_6: J8.6 ; port SWCLK
NetMODE_2: MODE.2 R13.2 ; port MODE BTN
NetR10_2: R10.2 TP-RX.1(=value) U2.1(TXD) ; port DBG UART RX
NetR11_2: R11.2 TP-TX.1(=value) U2.5(RXD) ; port DBG UART TX

Not connected (* = marked no-connect by the designer): D2 3(RED_-)* 4(Red_+)*; J8 7* 8* 9*; P1 4(ID)*; U2 2(DTR)* 3(RTS)* 6(RI)* 8(NC)* 9(DSR)* 10(DCD)* 11(CTS)* 12(CBUS4)* 13(CBUS2)* 14(CBUS3)* 19(RESET)* 22(CBUS1)* 23(CBUS0)* 24(NC)* 27(OSCI)* 28(OSCO)*

### Layout directives
differential pair: USB_N, USB_P

### Notes on the sheet
- Programming Header
- USB - UART Interface
- BUTTON MODE PUSH
- Resistor Calcs:
  Green: (3.3-2.9)/(20x10^-3) = 20
  Blue: (3.3-2.9)/(20x10^-3) = 20
- Debug Communication
- S. Kale
- 1.3
- A. Chaudhary
- January 3, 2021
- 3 of 4
- (in symbol TitleBlock) Title:; Drawing Engineer:; Revision:; Checking Engineer:; Date:; Notes:; Document Name:; Sheet:

### Library data of the parts
?#3 = TitleBlock: Standard Title Block
C6 C9 = CAP 0.1uF: as C1 on sheet SH1 - STM32; Supplier 1: Digi-Key; RoHS: Yes; Category: Ceramic Capacitors; Stock 1: 19996896; Pricing 1: 1=0.10000, 10=0.02100, 50=0.01140, 100=0.00930, 500=0.00666, 1000=0.00523, 2500=0.00476, 5000=0.00438 (USD); Mount: Surface Mount; Number of Pins: 2; Dielectric Material: Ceramic; Size Code: 0402; Terminal Finish: Nickel; Package Shape: Rectangular; Min Operating Temperature: -55°C; Max Operating Temperature: 125°C; JESD-609 Code: e3; Capacitor Type: Ceramic; Negative Tolerance: 10%; Packaging: Tape and Reel; Positive Tolerance: 10%; Rated DC Voltage (URdc): 16V; Temperature Characteristics Code: X7R; Termination: Wraparound; Package Style: SMTMeter; Length: 1mm; Width: 0.5mm; ComponentLink1URL: https://psearch.en.murata.com:443/capacitor/product/GRM155R71C104KA88%23.pdf?src-supplier=IHS+Markit; ComponentLink1Description: https://psearch.en.murata.com:443/capacitor/product/GRM155R71C104KA88%23.pdf?src-supplier=IHS+Markit; ComponentLink2URL: https://datasheet.ciiva.com/129/grm155r71c104ka88-01-129740.pdf?src-supplier=Digi-Key; ComponentLink2Description: https://datasheet.ciiva.com/129/grm155r71c104ka88-01-129740.pdf?src-supplier=Digi-Key; ComponentLink3URL: https://datasheet.ciiva.com/18102/getdatasheetpartid-85307-18102905.pdf?src-supplier=Verical; ComponentLink3Description: https://datasheet.ciiva.com/18102/getdatasheetpartid-85307-18102905.pdf?src-supplier=Verical; ComponentLink4URL: https://datasheet.ciiva.com/129/grm155r71c104ka88-01-129739.pdf?src-supplier=Digi-Key; ComponentLink4Description: https://datasheet.ciiva.com/129/grm155r71c104ka88-01-129739.pdf?src-supplier=Digi-Key; ComponentLink5URL: https://datasheet.ciiva.com/29199/454098-da-01-en-vs-kondensator-0402-29199799.pdf?src-supplier=Conrad; ComponentLink5Description: https://datasheet.ciiva.com/29199/454098-da-01-en-vs-kondensator-0402-29199799.pdf?src-supplier=Conrad; ComponentLink6URL: https://datasheet.ciiva.com/28534/4360-28534133.pdf?src-supplier=Element14; ComponentLink6Description: https://datasheet.ciiva.com/28534/4360-28534133.pdf?src-supplier=Element14; ComponentLink7URL: https://datasheet.ciiva.com/14103/grmseries-highdielectrictype-eng-14103750.pdf?src-supplier=Distrelec; ComponentLink7Description: https://datasheet.ciiva.com/14103/grmseries-highdielectrictype-eng-14103750.pdf?src-supplier=Distrelec; ComponentLink8URL: https://datasheet.ciiva.com/16199/product-16199000.pdf?src-supplier=Future+Electronics; ComponentLink8Description: https://datasheet.ciiva.com/16199/product-16199000.pdf?src-supplier=Future+Electronics; ComponentLink9URL: https://datasheet.ciiva.com/14116/grmseries-highdielectrictype-eng-14116878.pdf?src-supplier=Distrelec; ComponentLink9Description: https://datasheet.ciiva.com/14116/grmseries-highdielectrictype-eng-14116878.pdf?src-supplier=Distrelec; ComponentLink10URL: https://datasheet.ciiva.com/7937/4360-7937615.pdf?src-supplier=Element14; ComponentLink10Description: https://datasheet.ciiva.com/7937/4360-7937615.pdf?src-supplier=Element14; ComponentLink11URL: https://datasheet.ciiva.com/28534/4360-28534127.pdf?src-supplier=Element14; ComponentLink11Description: https://datasheet.ciiva.com/28534/4360-28534127.pdf?src-supplier=Element14; Height: 0.5mm; Supplier Part Number 1: 490-3261-1-ND
D2 = LED_RGB: as D1 on sheet SH1 - STM32; Supplier 1: Digi-Key; Manufacturer Part Number: 19-337C/RSBHGHC-A88/4T; RoHS: No; Category: LEDs; Stock 1: 109225; Pricing 1: 1=0.40000, 10=0.24400, 100=0.14030, 1000=0.10980, 2000=0.10065 (USD); Supplier Part Number 1: 1080-1631-1-ND
J8 = CON_STM32_PROGRAMMING: CONN HEADER SMD 10POS 1.27MM; Manufacturer 1: Samtec; Supplier 1: Digi-Key; Mounting Type: SMD; Pitch: 1.27mm; Supplier Part Number 1: SAM8796-ND; Package/Footprint: SMD
MODE S2 = SW_SPST_NO: SWITCH TACTILE SPST-NO 0.05A 12V; Manufacturer 1: Omron Electronics Inc-EMC Div; Package/Footprint: SMD; Manufacturer Part Number 1: B3U-1000P; Supplier 1: Digi-Key; Supplier Part Number 1: SW1020CT-ND; Mounting Type: SMD
P1 = USB Connector: USB Connector, 5 Contact(s), Female, Right Angle, Solder Terminal, Locking, Receptacle; Manufacturer: Amphenol FCI; Manufacturer Part Number: 10118193-0001LF; Manufacturer Series: 10118193; Contact Resistance: 30mR; Durability: 10000Cycles; Empty Shell: No; Insertion Force-Max: 35.1392N; Insulation Resistance: 1GR; Mating Information: MULTIPLE MATING PARTS AVAILABLE; Number Of Connectors: 1; PCB Contact Pattern: RECTANGULAR; Polarization Key: POLAR PIN POSITION; Rated Current (Signal): 1.8A; Number of Contacts: 5; Connector Type: TELECOM AND DATACOM CONNECTOR; Option: General Purpose; Board Mounting Option: LOCATING POSTS; Plating Thickness: 30uin; Body Breadth: 0.122inch; Body Depth: 0.199inch; Body Length: 0.309inch; Reference Standard: UL; Reliability: COMMERCIAL; Supplier 1: Digi-Key; RoHS: Yes; Category: USB Connectors; Stock 1: 43659; Pricing 1: 1=0.45000, 10=0.43000, 25=0.36840, 50=0.31320, 100=0.30090, 250=0.27016, 500=0.25788 (USD); ComponentLink1URL: https://datasheet.ciiva.com:443/pdfs/VipMasterIC/IC/FRCI/FRCI-S-A0000088532/FRCI-S-A0001133856-1.pdf?src-supplier=IHS+Markit; ComponentLink1Description: https://datasheet.ciiva.com:443/pdfs/VipMasterIC/IC/FRCI/FRCI-S-A0000088532/FRCI-S-A0001133856-1.pdf?src-supplier=IHS+Markit; Mount: Board; Insulation Material: Polymer; Shell Finish: Tin; Shell Material: Stainless Steel; Contact Material: Copper Alloy; Contact Finish - Mating: GOLD (30) OVER NICKEL; Contact Finish - Termination: GOLD FLASH OVER NICKEL; Contact Gender: Female; Contact Style: USB; Filter Feature: No; Mixed Contacts: No; Mounting Style: RIGHT ANGLE; Number Of PCB Rows: 1; Termination: Solder; JESD-609 Code: e4; Body/Shell Style: RECEPTACLE; Mounting Option 1: LOCKING; Terminal Pitch: 0.6604mm; Flammability Rating: UL94 V-0; DIN Conformance: No; IEC Conformance: No; MIL Conformance: No; ComponentLink2URL: https://datasheet.ciiva.com/851/10118193-851106.pdf?src-supplier=Digi-Key; ComponentLink2Description: https://datasheet.ciiva.com/851/10118193-851106.pdf?src-supplier=Digi-Key; ComponentLink3URL: https://datasheet.ciiva.com/26853/getdatasheetpartid-418618-26853893.pdf?src-supplier=Verical; ComponentLink3Description: https://datasheet.ciiva.com/26853/getdatasheetpartid-418618-26853893.pdf?src-supplier=Verical; ComponentLink4URL: https://datasheet.ciiva.com/4598/10118193ac-197151-4598799.pdf?src-supplier=Mouser; ComponentLink4Description: https://datasheet.ciiva.com/4598/10118193ac-197151-4598799.pdf?src-supplier=Mouser; ComponentLink5URL: https://datasheet.ciiva.com/14802/10118193-0001lf-webpage-14802386.pdf?src-supplier=Arrow+Electronics; ComponentLink5Description: https://datasheet.ciiva.com/14802/10118193-0001lf-webpage-14802386.pdf?src-supplier=Arrow+Electronics; ComponentLink6URL: https://datasheet.ciiva.com/851/10118193-851107.pdf?src-supplier=Digi-Key; ComponentLink6Description: https://datasheet.ciiva.com/851/10118193-851107.pdf?src-supplier=Digi-Key; ComponentLink7URL: https://datasheet.ciiva.com/851/10118193-851108.pdf?src-supplier=Digi-Key; ComponentLink7Description: https://datasheet.ciiva.com/851/10118193-851108.pdf?src-supplier=Digi-Key; ComponentLink8URL: https://datasheet.ciiva.com/14618/70236827-14618887.pdf?src-supplier=Allied+Electronics; ComponentLink8Description: https://datasheet.ciiva.com/14618/70236827-14618887.pdf?src-supplier=Allied+Electronics
R10 R11 = RES 20Ω: as R3 on sheet SH1 - STM32; Supplier 1: Digi-Key; Manufacturer Part Number: SDR03EZPJ200; RoHS: No; Category: Chip SMD Resistors; Stock 1: 3900; Pricing 1: 1=0.10000, 10=0.07300, 100=0.02800, 1000=0.01232, 2500=0.01064 (USD); Mount: Surface Mount; Number of Pins: 2; Package Shape: Rectangular; Size Code: 0603; Min Operating Temperature: -55°C; Max Operating Temperature: 155°C; Tolerance: 5%; Resistor Type: FIXED RESISTOR; Packaging: Tape and Reel; Termination: Wraparound; Working Voltage: 50V; ComponentLink1URL: https://datasheet.ciiva.com:443/pdfs/VipMasterIC/IC/ROHM/ROHM-S-A0002832543/ROHM-S-A0002832543-1.pdf?src-supplier=IHS+Markit; ComponentLink1Description: https://datasheet.ciiva.com:443/pdfs/VipMasterIC/IC/ROHM/ROHM-S-A0002832543/ROHM-S-A0002832543-1.pdf?src-supplier=IHS+Markit; ComponentLink2URL: https://www.rohm.com/datasheet/SDR03EZPJ/sdr-e?src-supplier=Digi-Key; ComponentLink2Description: https://www.rohm.com/datasheet/SDR03EZPJ/sdr-e?src-supplier=Digi-Key; Supplier Part Number 1: 511-1747-1-ND
R13 R18 = RES 10k Ω: as R7 on sheet SH2 - HBridge; Supplier 1: Digi-Key; RoHS: Yes; Category: Chip SMD Resistors; Stock 1: 6708; Pricing 1: 1=0.10000, 10=0.05900, 100=0.02390, 1000=0.01073, 2500=0.00932 (USD); ComponentLink1URL: https://datasheet.ciiva.com:443/pdfs/VipMasterIC/IC/YAGO/YAGO-S-A0003975721/YAGO-S-A0003975721-1.pdf?src-supplier=IHS+Markit; ComponentLink1Description: https://datasheet.ciiva.com:443/pdfs/VipMasterIC/IC/YAGO/YAGO-S-A0003975721/YAGO-S-A0003975721-1.pdf?src-supplier=IHS+Markit; ComponentLink2URL: http://www.yageo.com/NewPortal/yageodocoutput?fileName=/pdf/R-Chip/PYu-RE_105_RoHS_L_4.pdf&src-supplier=Digi-Key; ComponentLink2Description: http://www.yageo.com/NewPortal/yageodocoutput?fileName=/pdf/R-Chip/PYu-RE_105_RoHS_L_4.pdf&src-supplier=Digi-Key; Supplier Part Number 1: 13-RE1206FRE0710KLCT-ND
TP-RX TP-TX = TESTPT SQUARE
U2 = FT232RL: USB Bus Controller, CMOS, PDSO28; Manufacturer: FTDI; Manufacturer Part Number: FT232RL-REEL; Package Body Material: Plastic; Max Frequency: 48MHz; Max Supply Current: 100uA; Max Supply Voltage: 5.25V; Min Supply Voltage: 3.3V; Qualification Status: Not Qualified; Supplier 1: Digi-Key; RoHS: Yes; Category: Interface ICs; Stock 1: 118964; Pricing 1: 1=4.50000, 10=4.05000, 50=3.85000, 100=3.65000, 250=3.25000, 500=2.85002, 1000=2.65000 (USD); Package Code: SSOP; Number of Pins: 28; Package Shape: Rectangular; Min Operating Temperature: -40°C; Max Operating Temperature: 85°C; JESD-30 Code: R-PDSO-G28; Moisture Sensitivity Level: 3; Package Style: SMALL OUTLINE, SHRINK PITCHMeter; Surface Mount: Yes; Technology: CMOS; Terminal Form: Gull Wing; Terminal Position: DUAL; Length: 10.2mm; Width: 5.3mm; Height - Seated (Max): 2mm; Terminal Pitch: 0.65mm; Temperature Grade: INDUSTRIAL; ComponentLink1URL: https://datasheet.ciiva.com:443/pdfs/VipMasterIC/IC/FTDI/FTDI-S-A0007980421/FTDI-S-A0007980421-1.pdf?src-supplier=IHS+Markit; ComponentLink1Description: https://datasheet.ciiva.com:443/pdfs/VipMasterIC/IC/FTDI/FTDI-S-A0007980421/FTDI-S-A0007980421-1.pdf?src-supplier=IHS+Markit; ComponentLink2URL: https://datasheet.ciiva.com/34304/2161019-34304054.pdf?src-supplier=Jameco; ComponentLink2Description: https://datasheet.ciiva.com/34304/2161019-34304054.pdf?src-supplier=Jameco; ComponentLink3URL: https://datasheet.ciiva.com/4787/ds-ft232r-11534-4787658.pdf?src-supplier=Mouser; ComponentLink3Description: https://datasheet.ciiva.com/4787/ds-ft232r-11534-4787658.pdf?src-supplier=Mouser; ComponentLink4URL: https://datasheet.ciiva.com/26841/ft232rl-reel-26841080.pdf?src-supplier=IIIC; ComponentLink4Description: https://datasheet.ciiva.com/26841/ft232rl-reel-26841080.pdf?src-supplier=IIIC; ComponentLink5URL: https://datasheet.ciiva.com/1787/ds-ft232r-1787047.pdf?src-supplier=Digi-Key; ComponentLink5Description: https://datasheet.ciiva.com/1787/ds-ft232r-1787047.pdf?src-supplier=Digi-Key; ComponentLink6URL: https://datasheet.ciiva.com/1787/ds-ft232r-1787048.pdf?src-supplier=Digi-Key; ComponentLink6Description: https://datasheet.ciiva.com/1787/ds-ft232r-1787048.pdf?src-supplier=Digi-Key; ComponentLink7URL: https://datasheet.ciiva.com/1787/ds-ft232r-1787049.pdf?src-supplier=Digi-Key; ComponentLink7Description: https://datasheet.ciiva.com/1787/ds-ft232r-1787049.pdf?src-supplier=Digi-Key; ComponentLink8URL: https://datasheet.ciiva.com/15150/getdatasheetpartid-643207-15150506.pdf?src-supplier=Verical; ComponentLink8Description: https://datasheet.ciiva.com/15150/getdatasheetpartid-643207-15150506.pdf?src-supplier=Verical; ComponentLink9URL: https://datasheet.ciiva.com/16200/ds-ft232r-16200652.pdf?src-supplier=Future+Electronics; ComponentLink9Description: https://datasheet.ciiva.com/16200/ds-ft232r-16200652.pdf?src-supplier=Future+Electronics

## Sheet SH4 - PWM + CAN.SchDoc
size Letter
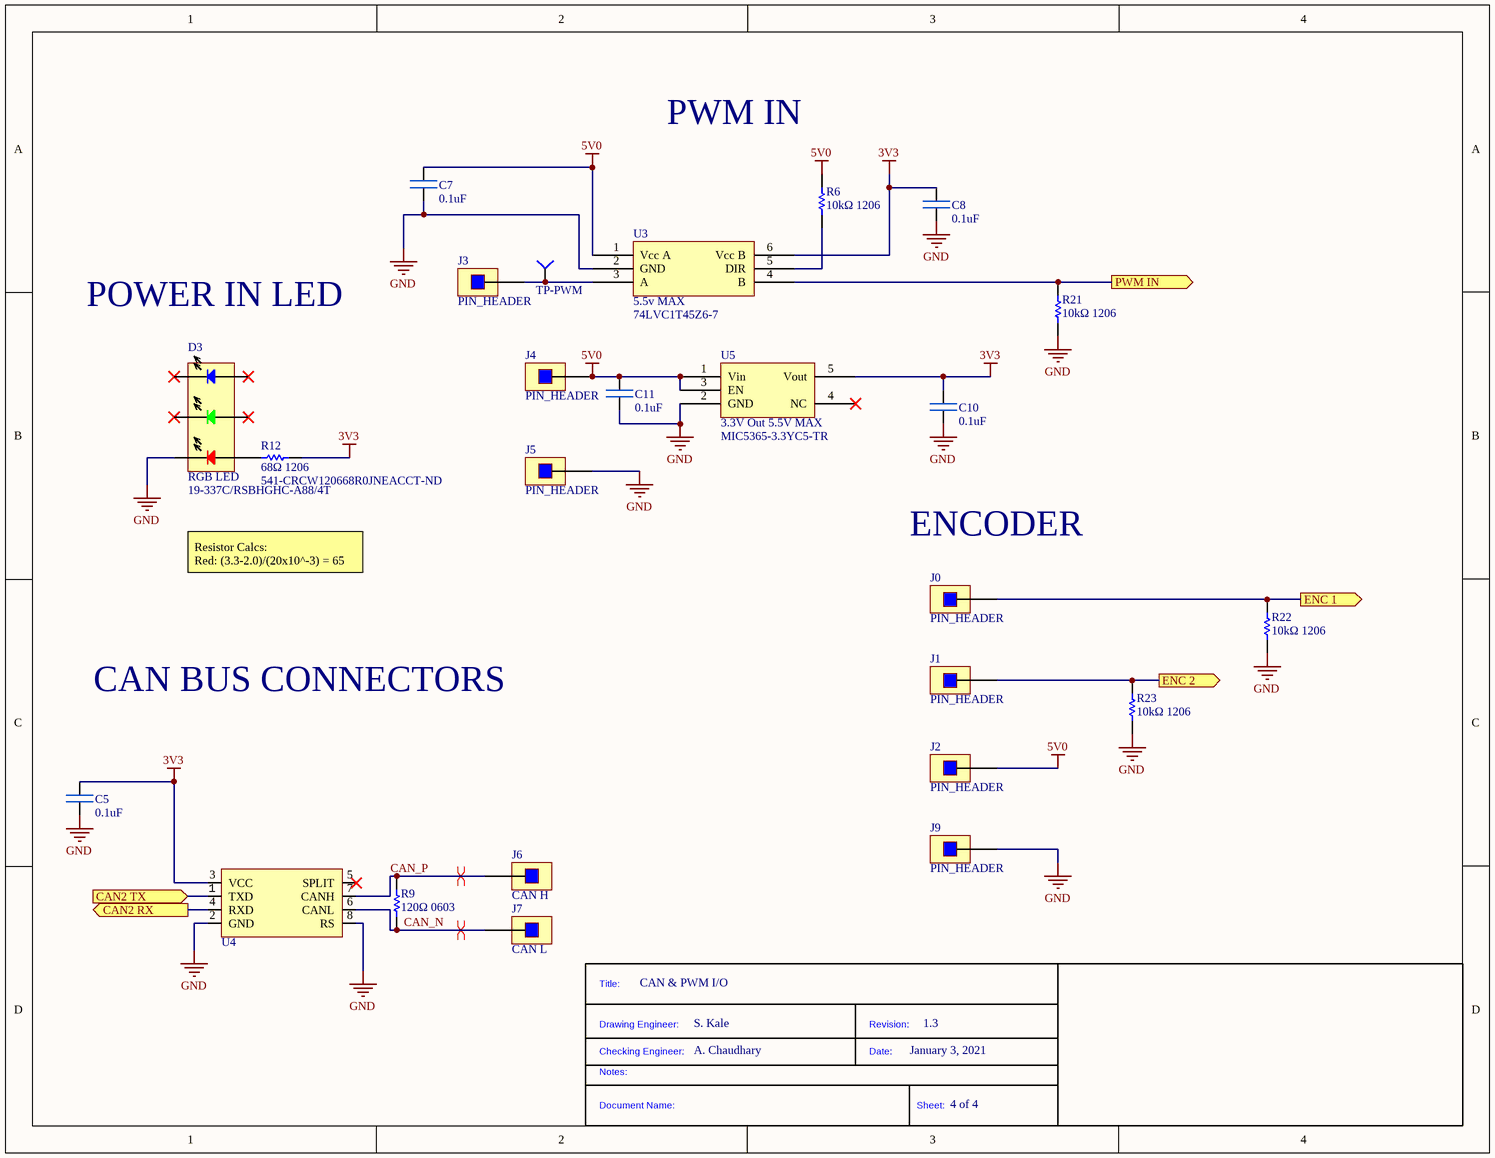
[diagram p3: SH4 - PWM + CAN.SchDoc]

### Parts
(Parts that share a designator on the sheet are numbered #1, #2 ... from top to bottom, then left to right.)
*?#3  HORNET LOGO  (value not drawn)  (graphical)
?#4  TitleBlock  (value not drawn)  (graphical)
C5  0.1uF  [CAP0.1uF]
C7  0.1uF  [CAP0.1uF]
C8  0.1uF  [CAP0.1uF]
C10  0.1uF  [CAP0.1uF]
C11  0.1uF  [CAP0.1uF]
D3  RGB LED  [19-337C/RSBHGHC-A88/4T]
J0  PIN_HEADER  [PIN_HEADER]
J1  PIN_HEADER  [PIN_HEADER]
J2  PIN_HEADER  [PIN_HEADER]
J3  PIN_HEADER  [PIN_HEADER]
J4  PIN_HEADER  [PIN_HEADER]
J5  PIN_HEADER  [PIN_HEADER]
J6  CAN H  [PIN_HEADER]
J7  CAN L  [PIN_HEADER]
J9  PIN_HEADER  [PIN_HEADER]
R6  10kΩ 1206  [13-RE1206FRE0710KLCT-ND]
R9  120Ω 0603  [SDR03EZPJ200]
R12  68Ω 1206  Supplier Part Number 1: 541-CRCW120668R0JNEACCT-ND  [CRCW120668R0JNEAC]
R21  10kΩ 1206  [13-RE1206FRE0710KLCT-ND]
R22  10kΩ 1206  [13-RE1206FRE0710KLCT-ND]
R23  10kΩ 1206  [13-RE1206FRE0710KLCT-ND]
TP-PWM  TESTPT  [TESTPT SQUARE]  (value not drawn)
U3  5.5v MAX  [74LVC1T45Z6-7]
U4  IC_CAN_TRANSCEIVER  [LT-S8_N]  (value not drawn)
U5  3.3V Out 5.5V MAX  [MIC5365-3.3YC5-TR]

### Ports
CAN2 RX (out), CAN2 TX (in), ENC 1 (out), ENC 2 (out), PWM IN (out)

### Nets
3V3: C5.1 C8.2 C10.1 R12.2 U3.6(Vcc_B) U4.3(VCC) U5.5(Vout)
5V0: C7.1 C11.1 J2.1 J4.1 R6.2 U3.1(Vcc_A) U5.1(Vin) U5.3(EN)
GND: C5.2 C7.2 C8.1 C10.2 C11.2 D3.3(RED_-) J5.1 J9.1 R21.1 R22.1 R23.1 U3.2(GND) U4.2(GND) U4.8(RS) U5.2(GND)
CAN_N: J7.1 R9.1 U4.6(CANL)
CAN_P: J6.1 R9.2 U4.7(CANH)
NetD3_4: D3.4(Red_+) R12.1
NetJ0_1: J0.1 R22.2 ; port ENC 1
NetJ1_1: J1.1 R23.2 ; port ENC 2
NetJ3_1: J3.1 TP-PWM.1(=value) U3.3(A)
NetR6_1: R6.1 U3.5(DIR)
NetR21_2: R21.2 U3.4(B) ; port PWM IN
NetTP-CRX_1: U4.4(RXD) ; port CAN2 RX
NetTP-CTX_1: U4.1(TXD) ; port CAN2 TX

Not connected (* = marked no-connect by the designer): D3 1(GREEN_-)* 2(Green_+)* 5(BLUE_-)* 6(Blue_+)*; U4 5(SPLIT)*; U5 4(NC)*

### Layout directives
differential pair: CAN_N, CAN_P

### Notes on the sheet
- PWM IN
- POWER IN LED
- Resistor Calcs:
  Red: (3.3-2.0)/(20x10^-3) = 65
- ENCODER
- CAN BUS CONNECTORS
- CAN & PWM I/O
- S. Kale
- 1.3
- A. Chaudhary
- January 3, 2021
- 4 of 4
- (in symbol TitleBlock) Title:; Drawing Engineer:; Revision:; Checking Engineer:; Date:; Notes:; Document Name:; Sheet:

### Library data of the parts
?#4 = TitleBlock: Standard Title Block
C5 C7 C8 C10 C11 = CAP 0.1uF: as C1 on sheet SH1 - STM32; Supplier 1: Digi-Key; RoHS: Yes; Category: Ceramic Capacitors; Stock 1: 19996896; Pricing 1: 1=0.10000, 10=0.02100, 50=0.01140, 100=0.00930, 500=0.00666, 1000=0.00523, 2500=0.00476, 5000=0.00438 (USD); Mount: Surface Mount; Number of Pins: 2; Dielectric Material: Ceramic; Size Code: 0402; Terminal Finish: Nickel; Package Shape: Rectangular; Min Operating Temperature: -55°C; Max Operating Temperature: 125°C; JESD-609 Code: e3; Capacitor Type: Ceramic; Negative Tolerance: 10%; Packaging: Tape and Reel; Positive Tolerance: 10%; Rated DC Voltage (URdc): 16V; Temperature Characteristics Code: X7R; Termination: Wraparound; Package Style: SMTMeter; Length: 1mm; Width: 0.5mm; ComponentLink1URL: https://psearch.en.murata.com:443/capacitor/product/GRM155R71C104KA88%23.pdf?src-supplier=IHS+Markit; ComponentLink1Description: https://psearch.en.murata.com:443/capacitor/product/GRM155R71C104KA88%23.pdf?src-supplier=IHS+Markit; ComponentLink2URL: https://datasheet.ciiva.com/129/grm155r71c104ka88-01-129740.pdf?src-supplier=Digi-Key; ComponentLink2Description: https://datasheet.ciiva.com/129/grm155r71c104ka88-01-129740.pdf?src-supplier=Digi-Key; ComponentLink3URL: https://datasheet.ciiva.com/18102/getdatasheetpartid-85307-18102905.pdf?src-supplier=Verical; ComponentLink3Description: https://datasheet.ciiva.com/18102/getdatasheetpartid-85307-18102905.pdf?src-supplier=Verical; ComponentLink4URL: https://datasheet.ciiva.com/129/grm155r71c104ka88-01-129739.pdf?src-supplier=Digi-Key; ComponentLink4Description: https://datasheet.ciiva.com/129/grm155r71c104ka88-01-129739.pdf?src-supplier=Digi-Key; ComponentLink5URL: https://datasheet.ciiva.com/29199/454098-da-01-en-vs-kondensator-0402-29199799.pdf?src-supplier=Conrad; ComponentLink5Description: https://datasheet.ciiva.com/29199/454098-da-01-en-vs-kondensator-0402-29199799.pdf?src-supplier=Conrad; ComponentLink6URL: https://datasheet.ciiva.com/28534/4360-28534133.pdf?src-supplier=Element14; ComponentLink6Description: https://datasheet.ciiva.com/28534/4360-28534133.pdf?src-supplier=Element14; ComponentLink7URL: https://datasheet.ciiva.com/14103/grmseries-highdielectrictype-eng-14103750.pdf?src-supplier=Distrelec; ComponentLink7Description: https://datasheet.ciiva.com/14103/grmseries-highdielectrictype-eng-14103750.pdf?src-supplier=Distrelec; ComponentLink8URL: https://datasheet.ciiva.com/16199/product-16199000.pdf?src-supplier=Future+Electronics; ComponentLink8Description: https://datasheet.ciiva.com/16199/product-16199000.pdf?src-supplier=Future+Electronics; ComponentLink9URL: https://datasheet.ciiva.com/14116/grmseries-highdielectrictype-eng-14116878.pdf?src-supplier=Distrelec; ComponentLink9Description: https://datasheet.ciiva.com/14116/grmseries-highdielectrictype-eng-14116878.pdf?src-supplier=Distrelec; ComponentLink10URL: https://datasheet.ciiva.com/7937/4360-7937615.pdf?src-supplier=Element14; ComponentLink10Description: https://datasheet.ciiva.com/7937/4360-7937615.pdf?src-supplier=Element14; ComponentLink11URL: https://datasheet.ciiva.com/28534/4360-28534127.pdf?src-supplier=Element14; ComponentLink11Description: https://datasheet.ciiva.com/28534/4360-28534127.pdf?src-supplier=Element14; Height: 0.5mm; Supplier Part Number 1: 490-3261-1-ND
D3 = LED_RGB: as D1 on sheet SH1 - STM32; Supplier 1: Digi-Key; Manufacturer Part Number: 19-337C/RSBHGHC-A88/4T; RoHS: No; Category: LEDs; Stock 1: 109225; Pricing 1: 1=0.40000, 10=0.24400, 100=0.14030, 1000=0.10980, 2000=0.10065 (USD); Supplier Part Number 1: 1080-1631-1-ND
J0-J7 J9 = PIN_HEADER: Board Connector, 1 Contact(s), 1 Row(s), Male, Straight, Solder Terminal; Manufacturer: Sullins; Manufacturer Part Number: PREC001SAAN-RC; Option: General Purpose; Filter Feature: No; Number of Rows Loaded: 1; Supplier 1: Digi-Key; RoHS: Yes; Category: Connectors; Stock 1: 16681; Pricing 1: 1=0.04000, 10=0.03000, 25=0.02800, 50=0.02080, 100=0.01780, 250=0.01724, 500=0.01486 (USD); Mount: Board; Connector Type: BOARD CONNECTOR; Contact Gender: Male; Mixed Contacts: No; Mounting Style: STRAIGHT; Termination: Solder; Number of Contacts: 1; Flammability Rating: UL94 V-0; DIN Conformance: No; IEC Conformance: No; MIL Conformance: No; ComponentLink1URL: https://datasheet.ciiva.com:443/pdfs/VipMasterIC/IC/SUCS/SUCS-S-A0005121173/SUCS-S-A0005121173-1.pdf?src-supplier=IHS+Markit; ComponentLink1Description: https://datasheet.ciiva.com:443/pdfs/VipMasterIC/IC/SUCS/SUCS-S-A0005121173/SUCS-S-A0005121173-1.pdf?src-supplier=IHS+Markit; ComponentLink2URL: https://datasheet.ciiva.com/740/zrzczzzszzn-rc-st-11635-b-740844.pdf?src-supplier=Digi-Key; ComponentLink2Description: https://datasheet.ciiva.com/740/zrzczzzszzn-rc-st-11635-b-740844.pdf?src-supplier=Digi-Key; Supplier Part Number 1: S1012EC-01-ND
R6 R21-R23 = RES 10k Ω: as R7 on sheet SH2 - HBridge; Supplier 1: Digi-Key; RoHS: Yes; Category: Chip SMD Resistors; Stock 1: 6708; Pricing 1: 1=0.10000, 10=0.05900, 100=0.02390, 1000=0.01073, 2500=0.00932 (USD); ComponentLink1URL: https://datasheet.ciiva.com:443/pdfs/VipMasterIC/IC/YAGO/YAGO-S-A0003975721/YAGO-S-A0003975721-1.pdf?src-supplier=IHS+Markit; ComponentLink1Description: https://datasheet.ciiva.com:443/pdfs/VipMasterIC/IC/YAGO/YAGO-S-A0003975721/YAGO-S-A0003975721-1.pdf?src-supplier=IHS+Markit; ComponentLink2URL: http://www.yageo.com/NewPortal/yageodocoutput?fileName=/pdf/R-Chip/PYu-RE_105_RoHS_L_4.pdf&src-supplier=Digi-Key; ComponentLink2Description: http://www.yageo.com/NewPortal/yageodocoutput?fileName=/pdf/R-Chip/PYu-RE_105_RoHS_L_4.pdf&src-supplier=Digi-Key; Supplier Part Number 1: 13-RE1206FRE0710KLCT-ND
R9 = RES 120: as R20 on sheet SH2 - HBridge; Supplier 1: Digi-Key; RoHS: No; Category: Chip SMD Resistors; Stock 1: 4798; Pricing 1: 1=0.10000, 10=0.07300, 100=0.02800, 1000=0.01232, 2500=0.01064 (USD); ComponentLink1URL: https://datasheet.ciiva.com:443/pdfs/VipMasterIC/IC/ROHM/ROHM-S-A0002832543/ROHM-S-A0002832543-1.pdf?src-supplier=IHS+Markit; ComponentLink1Description: https://datasheet.ciiva.com:443/pdfs/VipMasterIC/IC/ROHM/ROHM-S-A0002832543/ROHM-S-A0002832543-1.pdf?src-supplier=IHS+Markit; ComponentLink2URL: https://www.rohm.com/datasheet/SDR03EZPJ/sdr-e?src-supplier=Digi-Key; ComponentLink2Description: https://www.rohm.com/datasheet/SDR03EZPJ/sdr-e?src-supplier=Digi-Key; Supplier Part Number 1: 511-1735-1-ND
R12 = RES 68Ω: as R5 on sheet SH1 - STM32; Supplier 1: Digi-Key; Manufacturer Part Number: CRCW120668R0JNEAC; Stock 1: 24990; Pricing 1: 1=0.10000, 10=0.06300, 100=0.02570, 1000=0.01153, 2500=0.01000 (USD); Number of Pins: 2; Size Code: 1206; Terminal Finish: Nickel; Min Operating Temperature: -55°C; Max Operating Temperature: 155°C; JESD-609 Code: e3; Resistor Type: FIXED RESISTOR; Construction: Chip; Package Style: SMTMeter; Packaging: Tape and Reel; Technology: METAL GLAZE/THICK FILM; ComponentLink1URL: https://datasheet.ciiva.com:443/pdfs/VipMasterIC/IC/VISH/VISH-S-A0003599164/VISH-S-A0003599164-1.pdf?src-supplier=IHS+Markit; ComponentLink1Description: https://datasheet.ciiva.com:443/pdfs/VipMasterIC/IC/VISH/VISH-S-A0003599164/VISH-S-A0003599164-1.pdf?src-supplier=IHS+Markit
TP-PWM = TESTPT SQUARE
U3 = Bi-Directional Logic Converter: Bus Transceiver, LVC/LCX/Z Series, 1-Func, 1-Bit, True Output, CMOS, PDSO6; Manufacturer: Diodes; Package Body Material: Plastic; Control Type: COMMON CONTROL; Count Direction: Bidirectional; Load/Preset Input: Yes; Max I(ol): 24mA; Number of Bits: 1; Number of Ports: 2; Output Characteristics: 3-STATE; Power Supplies: 3.3V; Supply Voltage-Min (Vsup): 1.65V; Qualification Status: Not Qualified; Supplier 1: Digi-Key; Manufacturer Part Number: 74LVC1T45Z6-7; RoHS: Yes; Category: Logic ICs; Stock 1: 88129; Pricing 1: 1=0.39000, 10=0.29300, 25=0.26400, 100=0.18240, 250=0.15360, 500=0.12480, 1000=0.09600 (USD); Package Code: VSOF; Number of Pins: 6; Package Shape: Rectangular; Terminal Finish: Tin; Min Operating Temperature: -40°C; Max Operating Temperature: 125°C; JESD-609 Code: e3; Output Polarity: True; JESD-30 Code: R-PDSO-F6; Logic IC Type: BUS TRANSCEIVER; Moisture Sensitivity Level: 1; Number of Functions: 1; Package Style: SMALL OUTLINE, VERY THIN PROFILEMeter; Packaging: Tape and Reel; Supply Voltage-Max (Vsup): 5.5V; Supply Voltage-Nom (Vsup): 3.3V; Surface Mount: Yes; Technology: CMOS; Terminal Form: Flat; Terminal Position: DUAL; Width: 1.2mm; Height - Seated (Max): 0.6mm; Terminal Pitch: 0.5mm; Temperature Grade: AUTOMOTIVE; ComponentLink1URL: https://datasheet.ciiva.com:443/pdfs/VipMasterIC/IC/DIOD/DIOD-S-A0006644025/DIOD-S-A0006644025-1.pdf?src-supplier=IHS+Markit; ComponentLink1Description: https://datasheet.ciiva.com:443/pdfs/VipMasterIC/IC/DIOD/DIOD-S-A0006644025/DIOD-S-A0006644025-1.pdf?src-supplier=IHS+Markit; ComponentLink2URL: http://www.mouser.com/ds/2/115/74LVC1T45-318124.pdf?src-supplier=Mouser; ComponentLink2Description: http://www.mouser.com/ds/2/115/74LVC1T45-318124.pdf?src-supplier=Mouser; ComponentLink3URL: http://diodes.com/datasheets/74LVC1T45.pdf?src-supplier=Avnet; ComponentLink3Description: http://diodes.com/datasheets/74LVC1T45.pdf?src-supplier=Avnet; ComponentLink4URL: https://www.diodes.com/assets/Datasheets/74LVC1T45.pdf?src-supplier=Digi-Key; ComponentLink4Description: https://www.diodes.com/assets/Datasheets/74LVC1T45.pdf?src-supplier=Digi-Key; Supplier Part Number 1: 74LVC1T45Z6-7DICT-ND
U4 = IC_CAN_TRANSCEIVER: IC TXRX CAN 4MBPS 8SO; Manufacturer 1: Linear Technologies; Manufacturer Part Number 1: LTC2875IS8#PBF; Package/Footprint: 8-SOIC; Supplier Part Number 1: LTC2875IS8#PBF-ND; Supplier 1: Digi-Key; Mounting Type: SMD; LCSC Part #: C117076
U5 = LDO 5.5/3.3V: Microchip Technology MIC5365-3.3YC5-TR, LDO Voltage Regulator Controller, 150mA, 3.3 V, ±3% 5-Pin, SC-75; Supplier 1: Digi-Key; Manufacturer: Microchip; Manufacturer Part Number: MIC5365-3.3YC5-TR; RoHS: Yes; Category: Voltage Regulators - Linear; Stock 1: 5958; Pricing 1: 1=0.12000, 25=0.10000, 100=0.09000 (USD); ComponentLink1URL: https://datasheet.ciiva.com/16466/mic5365-16466603.pdf?src-supplier=Future+Electronics; ComponentLink1Description: https://datasheet.ciiva.com/16466/mic5365-16466603.pdf?src-supplier=Future+Electronics; Supplier Part Number 1: 576-3193-1-ND